# EAGLE design battery_shield (EAGLE 7.2.0)
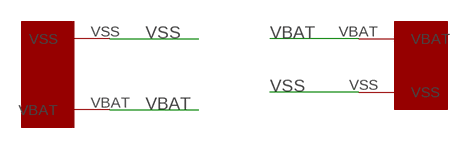
[diagram p0: schematic, sheet 1]

## Parts
U$1  EFL700  [EFL700]
U$2  EFL_COMMS  [EFL_COMMS]

## Nets
VBAT: U$1.VBAT U$2.VBAT
VSS: U$1.VSS U$2.VSS

## Library data of the parts
U$1 = voltage_regulators:EFL700
U$2 = voltage_regulators:EFL_COMMS

## Board
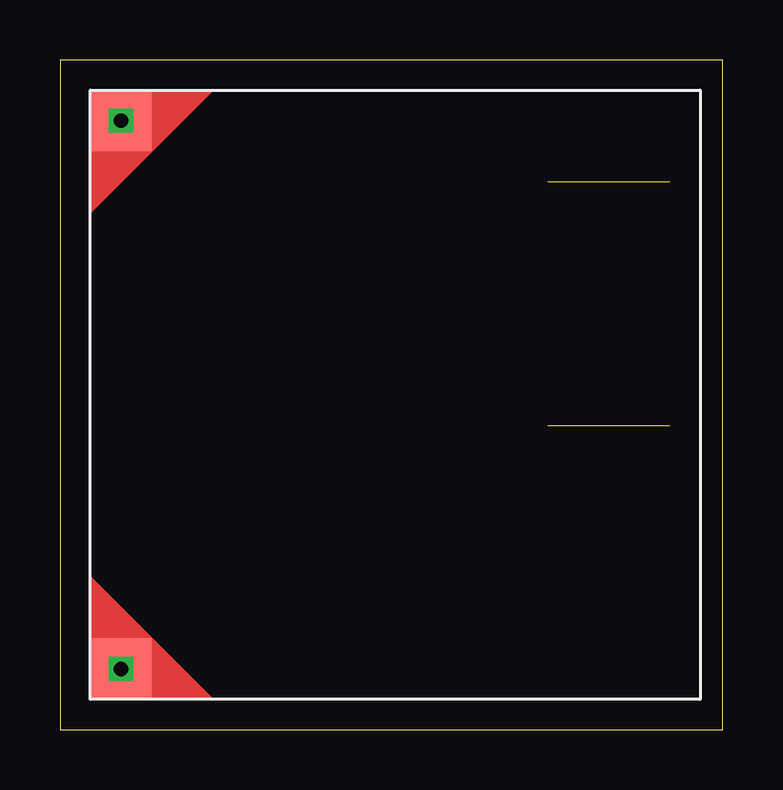
[diagram p1: board, top side]
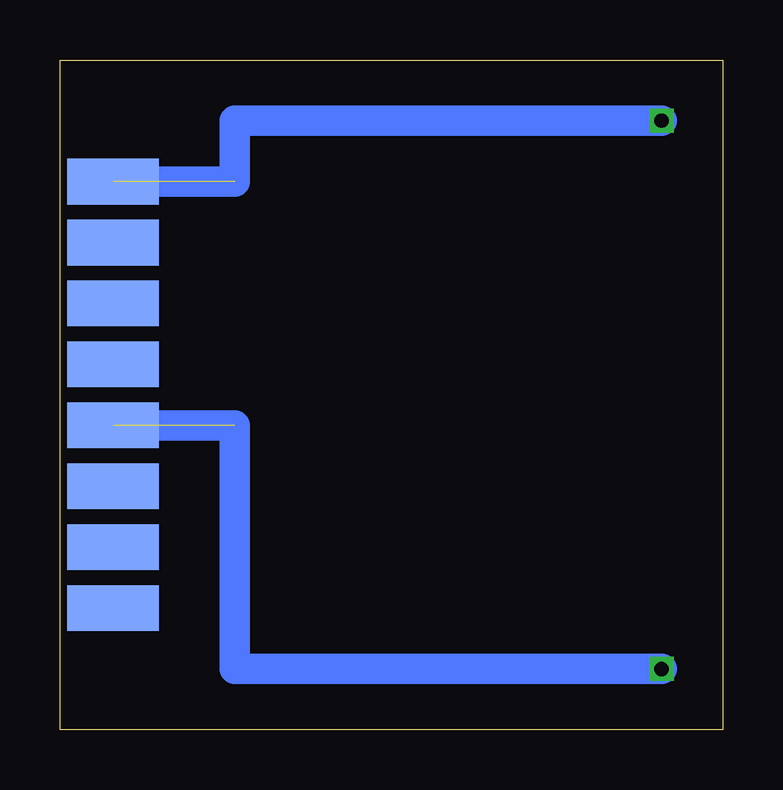
[diagram p2: board, bottom side, seen from below]

Size 27.61 x 27.93 mm. Coordinates in mm from the lower left corner, seen from the top.
Outline: 0,0 27.61,0 27.61,27.93 0,27.93 0,0
Copper layers (1*16): Top 0.035mm / dielectric 1.5mm / Bottom 0.035mm
Design rules "default": minimum track width 10mil, minimum drill 24mil, track to track 8mil, track to pad 8mil, pad to pad 8mil, via to via 8mil, smd to smd 8mil, copper to edge 40mil, drill to drill 8mil, minimum pad ring 10mil, minimum via ring 8mil, stop-mask expansion 4mil, vias tented up to drill 0mil, thermal gap 10mil

### Footprints (pad centres in the part's own frame; a part is rotated, then mirrored left to right if it is on the bottom)
EFL700 = smd 2.54 x 2.54: VBAT 1.27,1.27; VSS 1.27,24.13
EFL_COMMS = smd 3.81 x 1.905: P$9 8.89,2.54; P$10 8.89,5.08; P$11 8.89,7.62; P$13 8.89,12.7; P$14 8.89,15.24; P$15 8.89,17.78; VBAT 8.89,10.16; VSS 8.89,0

### Placement (x,y rotation side)
U$1  1.27,1.27 0 top
U$2  16.51,22.86 180 bottom

### Tracks (layer width: path | path; a pad name or v marks a point on that pad's centre or on a via)
VBAT  (via drill 0.6)  (2 unrouted)
  Bottom 1.27: U$1.VBAT 20.32,2.54 20.32,12.7
  other vias: 2.54,2.54
VSS  (via drill 0.6)  (2 unrouted)
  Bottom 1.27: U$1.VSS 20.32,25.4 20.32,22.86 24.13,22.86 | 20.32,12.7 24.13,12.7
  other vias: 2.54,25.4